# Altium project OK6010_DB.PrjPcb (part 1 of 2)
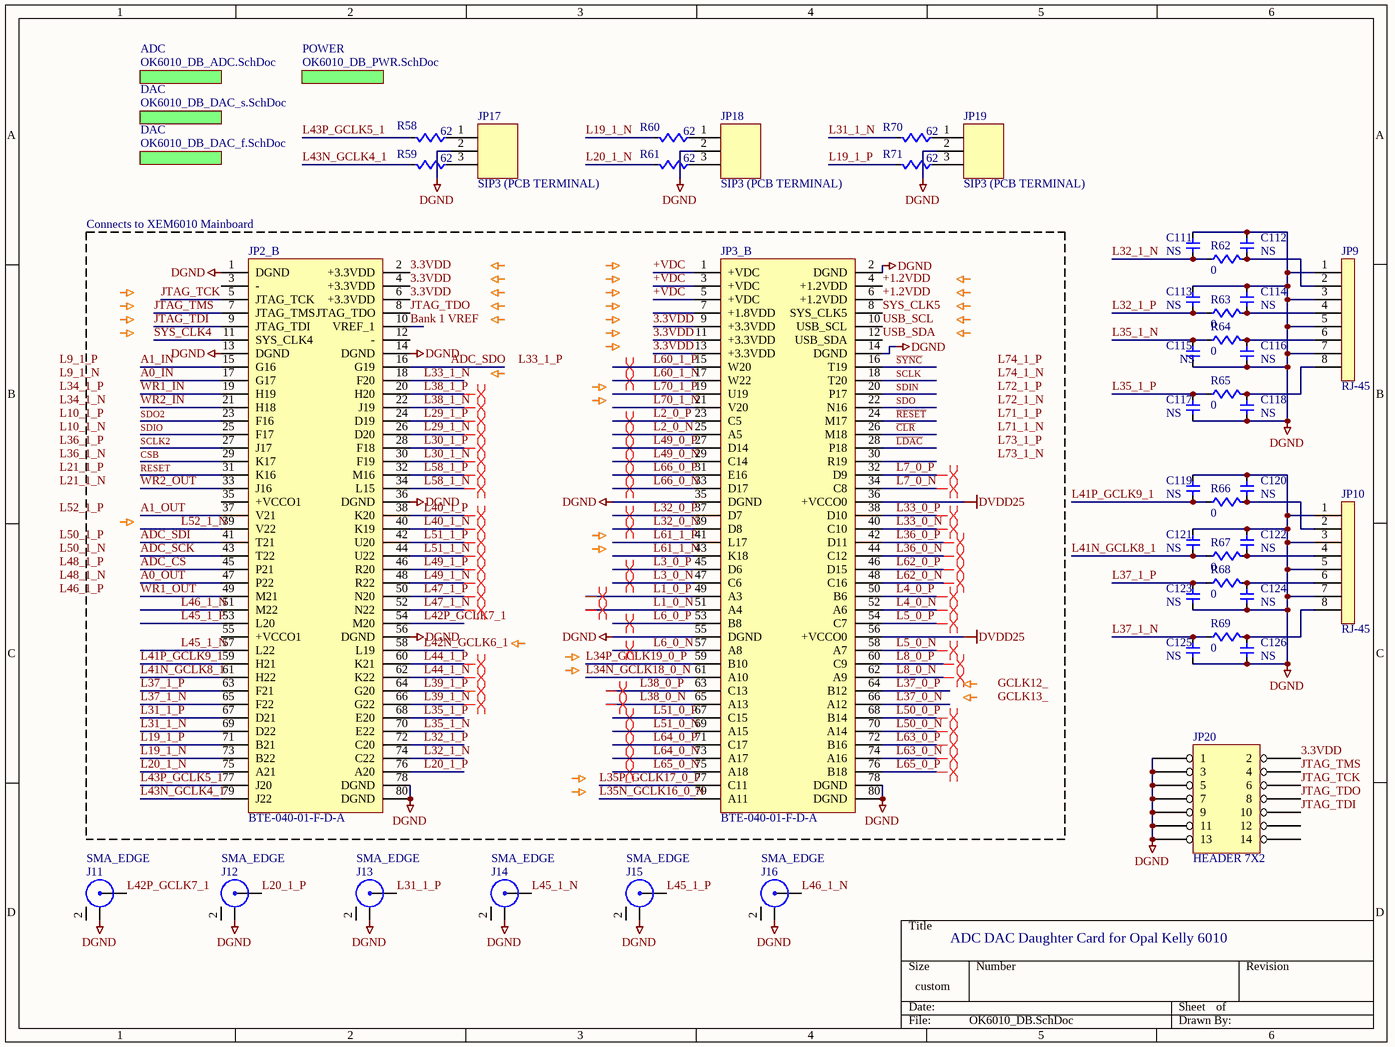
[diagram p0: OK6010_DB.SchDoc]
6 sheets, 268 parts. Net scope: global (net labels, ports and power ports of the same name join across sheets).
Board file: OK6010_DB.PcbDoc
Sheets:
  OK6010_DB.SchDoc
    ADC = OK6010_DB_ADC.SchDoc
    DAC = OK6010_DB_DAC_s.SchDoc
    DAC = OK6010_DB_DAC_f.SchDoc
    POWER = OK6010_DB_PWR.SchDoc
  OK6010_DB_pwr_bgt.SchDoc

## Sheet OK6010_DB.SchDoc
size 260 x 195 mm; PageSetup: Record=PageOptions|CenterHorizontal=True|CenterVertical=True|PrintScale=1.06|XCorrection=1.00|YCorrection=1.00|PrintKind=2|BorderSize=5000000|LeftOffset=0|BottomOffset=0|Orientation=2|PaperLength=1000|PaperWidth=1000|Scale=100|PaperSource=15|PrintQuality=600|MediaType=1|DitherType=10|PaperKind=Letter|PrintScaleMode=1

### Parts
C111  NS  [0603w]
C112  NS  [0603w]
C113  NS  [0603w]
C114  NS  [0603w]
C115  NS  [0603w]
C116  NS  [0603w]
C117  NS  [0603w]
C118  NS  [0603w]
C119  NS  [0603w]
C120  NS  [0603w]
C121  NS  [0603w]
C122  NS  [0603w]
C123  NS  [0603w]
C124  NS  [0603w]
C125  NS  [0603w]
C126  NS  [0603w]
J11  SMA_EDGE  [sma_edge]
J12  SMA_EDGE  [sma_edge]
J13  SMA_EDGE  [sma_edge]
J14  SMA_EDGE  [sma_edge]
J15  SMA_EDGE  [sma_edge]
J16  SMA_EDGE  [sma_edge]
JP2_B  BTE-040-01-F-D-A  [BTE-040-01-F-D-A]
JP3_B  BTE-040-01-F-D-A  [BTE-040-01-F-D-A]
JP9  RJ-45  [SMD_ETHERNET]
JP10  RJ-45  [SMD_ETHERNET]
JP17  SIP3 (PCB TERMINAL)  [SIP3MOLEX]
JP18  SIP3 (PCB TERMINAL)  [SIP3MOLEX]
JP19  SIP3 (PCB TERMINAL)  [SIP3MOLEX]
JP20  HEADER 7X2  [IDC14 SM 2MM]
R58  62  [0603w]
R59  62  [0603w]
R60  62  [0603w]
R61  62  [0603w]
R62  0  [0603w]
R63  0  [0603w]
R64  0  [0603w]
R65  0  [0603w]
R66  0  [0603w]
R67  0  [0603w]
R68  0  [0603w]
R69  0  [0603w]
R70  62  [0603w]
R71  62  [0603w]

### Blocks framed on the sheet
Connects to XEM6010 Mainboard: JP2_B JP3_B

### Sub-sheets
ADC = OK6010_DB_ADC.SchDoc: no entries
DAC = OK6010_DB_DAC_s.SchDoc: no entries
DAC = OK6010_DB_DAC_f.SchDoc: no entries
POWER = OK6010_DB_PWR.SchDoc: no entries

### Nets
DGND: C111.1 C112.1 C113.1 C114.1 C115.2 C116.2 C117.2 C118.2 C119.1 C120.1 C121.1 C122.1 C123.2 C124.2 C125.2 C126.2 J11.2(ground) J12.2(ground) J13.2(ground) J14.2(ground) J15.2(ground) J16.2(ground) JP2_B.1(DGND) JP2_B.13(DGND) JP2_B.14(DGND) JP2_B.36(DGND) JP2_B.56(DGND) JP2_B.78(DGND) JP2_B.80(DGND) JP3_B.2(DGND) JP3_B.14(DGND) JP3_B.35(DGND) JP3_B.55(DGND) JP3_B.78(DGND) JP3_B.80(DGND) JP9.1 JP9.3 JP9.5 JP9.7 JP10.1 JP10.3 JP10.5 JP10.7 JP17.2 JP18.2 JP19.2 JP20.1 JP20.3 JP20.5 JP20.7 JP20.9 JP20.11 JP20.13  [project net AGND]
DVDD25: JP3_B.36(+VCCO0) JP3_B.56(+VCCO0)
3.3VDD: JP2_B.2(+3.3VDD) JP2_B.4(+3.3VDD) JP2_B.6(+3.3VDD) JP3_B.9(+3.3VDD) JP3_B.11(+3.3VDD) JP3_B.13(+3.3VDD) JP20.2
+1.2VDD: JP3_B.4(+1.2VDD) JP3_B.6(+1.2VDD)
+VDC: JP3_B.1(+VDC) JP3_B.3(+VDC) JP3_B.5(+VDC)
A0_IN: JP2_B.17(G17)
A0_OUT: JP2_B.47(P22)
A1_IN: JP2_B.15(G16)
A1_OUT: JP2_B.37(V21)
ADC_CS: JP2_B.45(P21)
ADC_SCK: JP2_B.43(T22)
ADC_SDI: JP2_B.41(T21)
ADC_SDO: JP2_B.16(G19)
Bank 1 VREF: JP2_B.10(VREF_1)
~{CLR}: JP3_B.26(M18)
CSB: JP2_B.29(K17)
JTAG_TCK: JP2_B.5(JTAG_TCK) JP20.6
JTAG_TDI: JP2_B.9(JTAG_TDI) JP20.10
JTAG_TDO: JP2_B.8(JTAG_TDO) JP20.8
JTAG_TMS: JP2_B.7(JTAG_TMS) JP20.4
L1_0_N: JP3_B.51(A4)
L1_0_P: JP3_B.49(A3)
L2_0_N: JP3_B.25(A5)
L2_0_P: JP3_B.23(C5)
L3_0_N: JP3_B.47(C6)
L3_0_P: JP3_B.45(D6)
L4_0_N: JP3_B.52(A6)
L4_0_P: JP3_B.50(B6)
L5_0_N: JP3_B.58(A7)
L5_0_P: JP3_B.54(C7)
L6_0_N: JP3_B.57(A8)
L6_0_P: JP3_B.53(B8)
L7_0_N: JP3_B.34(C8)
L7_0_P: JP3_B.32(D9)
L8_0_N: JP3_B.62(A9)
L8_0_P: JP3_B.60(C9)
L19_1_N: JP2_B.73(B22) R60.2
L19_1_P: JP2_B.71(B21) R71.2
L20_1_N: JP2_B.75(A21) R61.2
L20_1_P: J12.1(signal) JP2_B.76(A20)
L29_1_N: JP2_B.26(D20)
L29_1_P: JP2_B.24(D19)
L30_1_N: JP2_B.30(F19)
L30_1_P: JP2_B.28(F18)
L31_1_N: JP2_B.69(D22) R70.2
L31_1_P: J13.1(signal) JP2_B.67(D21)
L32_0_N: JP3_B.39(D8)
L32_0_P: JP3_B.37(D7)
L32_1_N: C111.2 JP2_B.74(C22) R62.1
L32_1_P: C113.2 JP2_B.72(C20) R63.1
L33_0_N: JP3_B.40(C10)
L33_0_P: JP3_B.38(D10)
L33_1_N: JP2_B.18(F20)
L34N_GCLK18_0_N: JP3_B.61(A10)
L34P_GCLK19_0_P: JP3_B.59(B10)
L35_1_N: C115.1 JP2_B.70(E22) R64.1
L35_1_P: C117.1 JP2_B.68(E20) R65.1
L35N_GCLK16_0_N: JP3_B.79(A11)
L35P_GCLK17_0_P: JP3_B.77(C11)
L36_0_N: JP3_B.44(C12)
L36_0_P: JP3_B.42(D11)
L37_0_N: JP3_B.66(A12)
L37_0_P: JP3_B.64(B12)
L37_1_N: C125.1 JP2_B.65(F22) R69.1
L37_1_P: C123.1 JP2_B.63(F21) R68.1
L38_0_N: JP3_B.65(A13)
L38_0_P: JP3_B.63(C13)
L38_1_N: JP2_B.22(J19)
L38_1_P: JP2_B.20(H20)
L39_1_N: JP2_B.66(G22)
L39_1_P: JP2_B.64(G20)
L40_1_N: JP2_B.40(K19)
L40_1_P: JP2_B.38(K20)
L41N_GCLK8_1: C121.2 JP2_B.61(H22) R67.1
L41P_GCLK9_1: C119.2 JP2_B.59(H21) R66.1
L42N_GCLK6_1: JP2_B.58(L19)
L42P_GCLK7_1: J11.1(signal) JP2_B.54(M20)
L43N_GCLK4_1: JP2_B.79(J22) R59.2
L43P_GCLK5_1: JP2_B.77(J20) R58.2
L44_1_N: JP2_B.62(K22)
L44_1_P: JP2_B.60(K21)
L45_1_N: J14.1(signal) JP2_B.57(L22)
L45_1_P: J15.1(signal) JP2_B.53(L20)
L46_1_N: J16.1(signal) JP2_B.51(M22)
L47_1_N: JP2_B.52(N22)
L47_1_P: JP2_B.50(N20)
L49_0_N: JP3_B.29(C14)
L49_0_P: JP3_B.27(D14)
L49_1_N: JP2_B.48(R22)
L49_1_P: JP2_B.46(R20)
L50_0_N: JP3_B.70(A14)
L50_0_P: JP3_B.68(B14)
L51_0_N: JP3_B.69(A15)
L51_0_P: JP3_B.67(C15)
L51_1_N: JP2_B.44(U22)
L51_1_P: JP2_B.42(U20)
L52_1_N: JP2_B.39(V22)
L58_1_N: JP2_B.34(L15)
L58_1_P: JP2_B.32(M16)
L60_1_N: JP3_B.17(W22)
L60_1_P: JP3_B.15(W20)
L61_1_N: JP3_B.43(K18)
L61_1_P: JP3_B.41(L17)
L62_0_N: JP3_B.48(C16)
L62_0_P: JP3_B.46(D15)
L63_0_N: JP3_B.74(A16)
L63_0_P: JP3_B.72(B16)
L64_0_N: JP3_B.73(A17)
L64_0_P: JP3_B.71(C17)
L65_0_N: JP3_B.75(A18)
L65_0_P: JP3_B.76(B18)
L66_0_N: JP3_B.33(D17)
L66_0_P: JP3_B.31(E16)
L70_1_N: JP3_B.21(V20)
L70_1_P: JP3_B.19(U19)
~{LDAC}: JP3_B.28(P18)
~{RESET}: JP3_B.24(M17)
RESET: JP2_B.31(K16)
~{SYNC}: JP3_B.16(T19)
SCLK: JP3_B.18(T20)
SCLK2: JP2_B.27(J17)
SDIN: JP3_B.20(P17)
SDIO: JP2_B.25(F17)
SDO: JP3_B.22(N16)
SDO2: JP2_B.23(F16)
SYS_CLK4: JP2_B.11(SYS_CLK4)
SYS_CLK5: JP3_B.8(SYS_CLK5)
USB_SCL: JP3_B.10(USB_SCL)
USB_SDA: JP3_B.12(USB_SDA)
WR1_IN: JP2_B.19(H19)
WR1_OUT: JP2_B.49(M21)
WR2_IN: JP2_B.21(H18)
WR2_OUT: JP2_B.33(J16)
NetC112_2: C112.2 JP9.2 R62.2
NetC114_2: C114.2 JP9.4 R63.2
NetC116_1: C116.1 JP9.6 R64.2
NetC118_1: C118.1 JP9.8 R65.2
NetC120_2: C120.2 JP10.2 R66.2
NetC122_2: C122.2 JP10.4 R67.2
NetC124_1: C124.1 JP10.6 R68.2
NetC126_1: C126.1 JP10.8 R69.2
NetJP17_1: JP17.1 R58.1
NetJP17_3: JP17.3 R59.1
NetJP18_1: JP18.1 R60.1
NetJP18_3: JP18.3 R61.1
NetJP19_1: JP19.1 R70.1
NetJP19_3: JP19.3 R71.1

Not connected (* = marked no-connect by the designer): JP2_B 3(-) 12(-) 35(+VCCO1) 55(+VCCO1); JP3_B 7(+1.8VDD) 30(R19); JP20 12 14

### Layout directives
differential pair: L1_0_N, L1_0_P, L2_0_N, L2_0_P, L3_0_N, L3_0_P, L4_0_N, L4_0_P, L5_0_N, L5_0_P, L6_0_N, L6_0_P, L7_0_N, L7_0_P, L8_0_N, L8_0_P, L29_1_N, L29_1_P, L30_1_N, L30_1_P, L32_0_N, L32_0_P, L33_0_N, L33_0_P, L36_0_N, L36_0_P, L38_0_N, L38_0_P, L38_1_N, L38_1_P, L39_1_N, L39_1_P, L40_1_N, L40_1_P, L44_1_N, L44_1_P, L47_1_N, L47_1_P, L49_0_N, L49_0_P, L49_1_N, L49_1_P, L50_0_N, L50_0_P, L51_0_N, L51_0_P, L51_1_N, L51_1_P, L58_1_N, L58_1_P, L60_1_N, L60_1_P, L62_0_N, L62_0_P, L63_0_N, L63_0_P, L64_0_N, L64_0_P, L65_0_N, L65_0_P, L66_0_N, L66_0_P

### Notes on the sheet
- ADC DAC Daughter Card for Opal Kelly 6010
- Labels drawn without touching a wire or pin: GCLK12_, GCLK13_, L9_1_N, L9_1_P, L10_1_N, L10_1_P, L21_1_N, L21_1_P, L33_1_P, L34_1_N, L34_1_P, L36_1_N, L36_1_P, L46_1_P, L48_1_N, L48_1_P, L50_1_N, L50_1_P, L52_1_P, L71_1_N, L71_1_P, L72_1_N, L72_1_P, L73_1_N, L73_1_P, L74_1_N, L74_1_P

### Library data of the parts
C111-C126 = CAP_SM: capacitor
J11-J16 = SMA_EDGE: sma edge connector; Supplier 1: Digi-Key; Supplier Part Number 1: ACX1426-ND
JP2_B = BTE-040-01-F-D-A XEM6010_JP2: Samtec Connector 0.8mm 80pin; Supplier 1: Newark; Supplier Part Number 1: 89M7080
JP3_B = BTE-040-01-F-D-A XEM6010_JP3: Samtec Connector 0.8mm 80pin; Supplier 1: Newark; Supplier Part Number 1: 89M7080
JP9 JP10 = SIP8: ethernet connector; Supplier 1: Digi-Key; Supplier Part Number 1: RJSSE-5080-ND
JP17-JP19 = SIP3 (PCB TERMINAL): 3 pin molex connector; Supplier 1: Digi-Key; Supplier Part Number 1: WM2745-ND
JP20 = HEADER 7X2: 14 pin 2mm IDC connector; Supplier 1: Digi-Key; Supplier Part Number 1: WM18641-ND
R58-R71 = RES_SM: resistor; Supplier 1: Digi-Key
  R58-R61 R70 R71: Supplier Part Number 1: 541-62.0HCT-ND
  R62-R69: Supplier Part Number 1: P0.0GCT-ND

## Sheet OK6010_DB_ADC.SchDoc
size 260 x 195 mm; PageSetup: Record=PageOptions|CenterHorizontal=True|CenterVertical=True|PrintScale=0.82|XCorrection=1.00|YCorrection=1.00|PrintKind=2|BorderSize=5000000|LeftOffset=0|BottomOffset=0|Orientation=2|PaperLength=1000|PaperWidth=1000|Scale=100|PaperSource=15|PrintQuality=600|MediaType=1|DitherType=10|PaperKind=Letter|PrintScaleMode=1
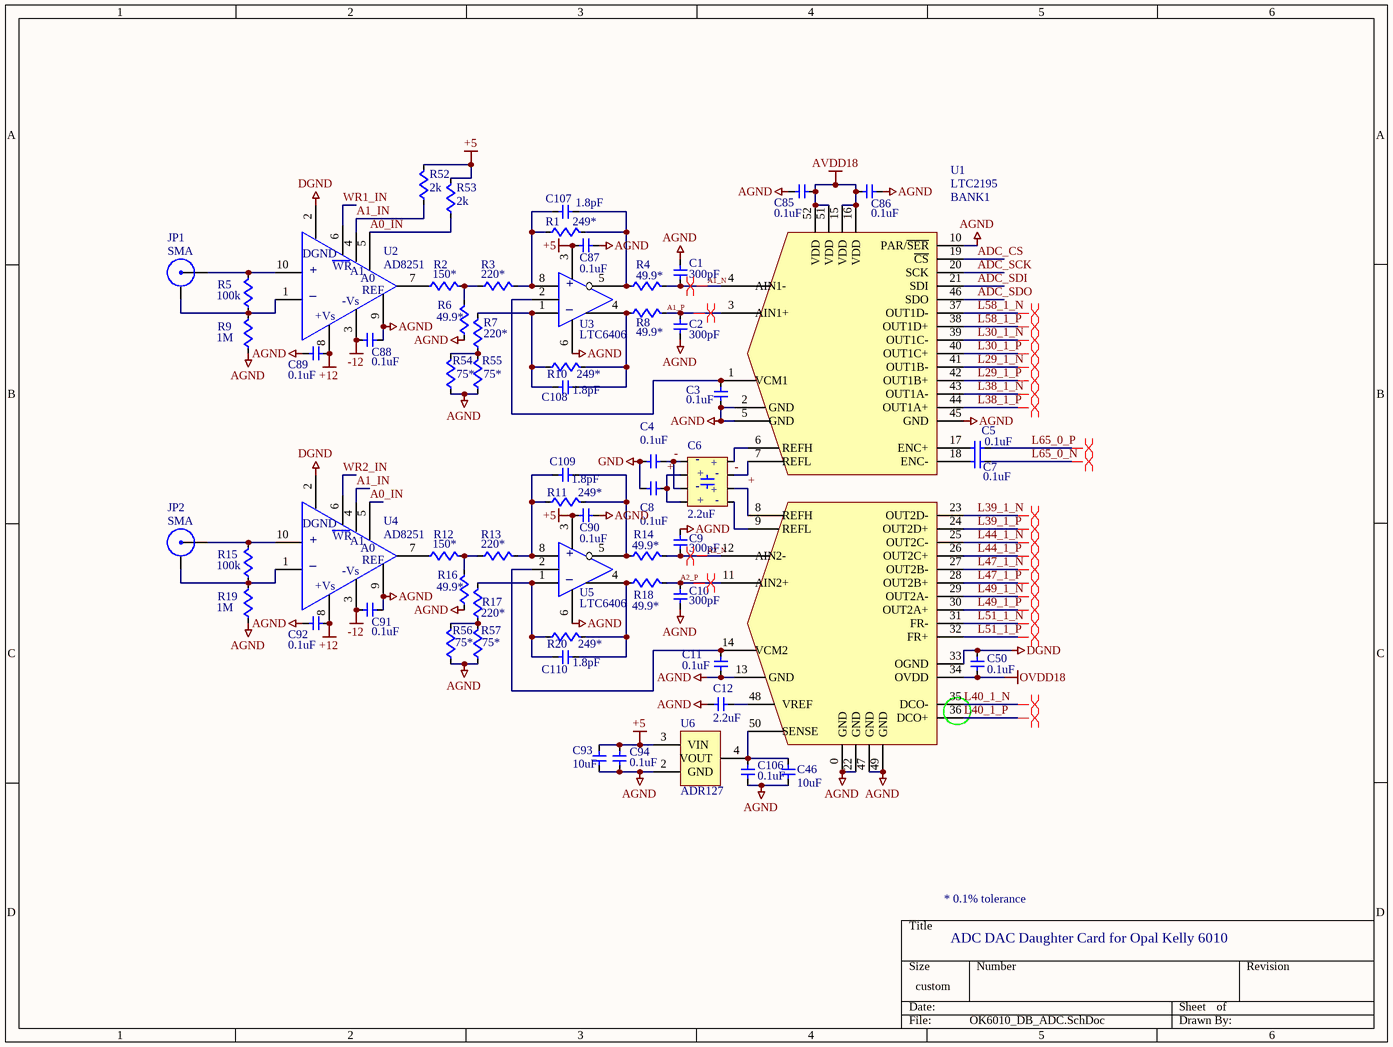
[diagram p1: OK6010_DB_ADC.SchDoc]

### Parts
C1  300pF  [0603w]
C2  300pF  [0603w]
C3  0.1uF  [0603w]
C4  0.1uF  [0603w]
C5  0.1uF  [1206]
C6  2.2uF  [0805 CLL]
C7  0.1uF  [1206]
C8  0.1uF  [0603w]
C9  300pF  [0603w]
C10  300pF  [0603w]
C11  0.1uF  [0603w]
C12  2.2uF  [0603w]
C46  10uF  [0603w]
C50  0.1uF  [0603w]
C85  0.1uF  [0603w]
C86  0.1uF  [0603w]
C87  0.1uF  [0603w]
C88  0.1uF  [0603w]
C89  0.1uF  [0603w]
C90  0.1uF  [0603w]
C91  0.1uF  [0603w]
C92  0.1uF  [0603w]
C93  10uF  [0603w]
C94  0.1uF  [0603w]
C106  0.1uF  [0603w]
C107  1.8pF  [0603w]
C108  1.8pF  [0603w]
C109  1.8pF  [0603w]
C110  1.8pF  [0603w]
JP1  SMA  [sma_pcb_200]
JP2  SMA  [sma_pcb_200]
R1  249*  [0603w]
R2  150*  [0603w]
R3  220*  [0603w]
R4  49.9*  [0603w]
R5  100k  [0603w]
R6  49.9*  [0603w]
R7  220*  [0603w]
R8  49.9*  [0603w]
R9  1M  [0603w]
R10  249*  [0603w]
R11  249*  [0603w]
R12  150*  [0603w]
R13  220*  [0603w]
R14  49.9*  [0603w]
R15  100k  [0603w]
R16  49.9*  [0603w]
R17  220*  [0603w]
R18  49.9*  [0603w]
R19  1M  [0603w]
R20  249*  [0603w]
R52  2k  [0603w]
R53  2k  [0603w]
R54  75*  [0603w]
R55  75*  [0603w]
R56  75*  [0603w]
R57  75*  [0603w]
U1  LTC2195  [UKG - QFN52]
U2  AD8251  [MSOP10sm]
U3  LTC6406  [MSOP08]
U4  AD8251  [MSOP10sm]
U5  LTC6406  [MSOP08]
U6  ADR127  [TSOT-6]

### Nets
+5: C87.1 C90.1 C93.1 C94.2 R52.2 R53.2 U3.3 U5.3 U6.3(VIN)
+12: C89.1 C92.1 U2.8 U4.8
-12: C88.1 C91.1 U2.3 U4.3
AGND: C1.1 C2.2 C3.2 C4.2 C8.2 C9.1 C10.2 C11.2 C12.2 C46.2 C50.1 C85.2 C86.2 C87.2 C88.2 C89.2 C90.2 C91.2 C92.2 C93.2 C94.1 C106.1 R6.1 R9.1 R16.1 R19.1 R54.1 R55.1 R56.1 R57.1 U1.0(GND) U1.2(GND) U1.5(GND) U1.10(PAR/~{SER}) U1.13(GND) U1.22(GND) U1.33(OGND) U1.45(GND) U1.47(GND) U1.49(GND) U2.2 U2.9 U3.6 U4.2 U4.9 U5.6 U6.2(GND)  [also labelled DGND, GND]
AVDD18: C85.1 C86.1 U1.15(VDD) U1.16(VDD) U1.51(VDD) U1.52(VDD)
OVDD18: C50.2 U1.34(OVDD)
+: C6.2 C6.4 C6.6 C8.1 U1.8(REFH)
-: C4.1 C6.1 C6.3 C6.7 U1.7(REFL)
A0_IN: R53.1 U2.5 U4.5
A1_IN: R52.1 U2.4 U4.4
A1_N: C1.2 R4.2 U1.4(AIN1-)
A1_P: C2.1 R8.2 U1.3(AIN1+)
A2_N: C9.2 R14.2 U1.12(AIN2-)
A2_P: C10.1 R18.2 U1.11(AIN2+)
ADC_CS: U1.19(~{CS})
ADC_SCK: U1.20(SCK)
ADC_SDI: U1.21(SDI)
ADC_SDO: U1.46(SDO)
L29_1_N: U1.41(OUT1B-)
L29_1_P: U1.42(OUT1B+)
L30_1_N: U1.39(OUT1C-)
L30_1_P: U1.40(OUT1C+)
L38_1_N: U1.43(OUT1A-)
L38_1_P: U1.44(OUT1A+)
L39_1_N: U1.23(OUT2D-)
L39_1_P: U1.24(OUT2D+)
L40_1_N: U1.35(DCO-)
L40_1_P: U1.36(DCO+)
L44_1_N: U1.25(OUT2C-)
L44_1_P: U1.26(OUT2C+)
L47_1_N: U1.27(OUT2B-)
L47_1_P: U1.28(OUT2B+)
L49_1_N: U1.29(OUT2A-)
L49_1_P: U1.30(OUT2A+)
L51_1_N: U1.31(FR-)
L51_1_P: U1.32(FR+)
L58_1_N: U1.37(OUT1D-)
L58_1_P: U1.38(OUT1D+)
L65_0_N: C7.2
L65_0_P: C5.2
WR1_IN: U2.6
WR2_IN: U4.6
NetC3_1: C3.1 U1.1(VCM1) U3.2
NetC5_1: C5.1 U1.17(ENC+)
NetC6_5: C6.5 U1.9(REFL)
NetC6_8: C6.8 U1.6(REFH)
NetC7_1: C7.1 U1.18(ENC-)
NetC11_1: C11.1 U1.14(VCM2) U5.2
NetC12_1: C12.1 U1.48(VREF)
NetC46_1: C46.1 C106.2 U1.50(SENSE) U6.4(VOUT)
NetC107_1: C107.1 R1.1 R3.2 U3.8
NetC107_2: C107.2 R1.2 R4.1 U3.5
NetC108_1: C108.1 R7.2 R10.1 U3.1
NetC108_2: C108.2 R8.1 R10.2 U3.4
NetC109_1: C109.1 R11.1 R13.2 U5.8
NetC109_2: C109.2 R11.2 R14.1 U5.5
NetC110_1: C110.1 R17.2 R20.1 U5.1
NetC110_2: C110.2 R18.1 R20.2 U5.4
NetJP1_0: JP1.0(ground) R5.1 R9.2 U2.1
NetJP1_1: JP1.1(signal) R5.2 U2.10
NetJP2_0: JP2.0(ground) R15.1 R19.2 U4.1
NetJP2_1: JP2.1(signal) R15.2 U4.10
NetR2_1: R2.1 U2.7
NetR2_2: R2.2 R3.1 R6.2
NetR7_1: R7.1 R54.2 R55.2
NetR12_1: R12.1 U4.7
NetR12_2: R12.2 R13.1 R16.2
NetR17_1: R17.1 R56.2 R57.2

Not connected (* = marked no-connect by the designer): U6 1(NC) 5(NC) 6(NC)

### Layout directives
differential pair: A1_N, A1_P, A2_N, A2_P, L29_1_N, L29_1_P, L30_1_N, L30_1_P, L38_1_N, L38_1_P, L39_1_N, L39_1_P, L40_1_N, L40_1_P, L44_1_N, L44_1_P, L47_1_N, L47_1_P, L49_1_N, L49_1_P, L51_1_N, L51_1_P, L58_1_N, L58_1_P, L65_0_N, L65_0_P

### Notes on the sheet
- (near U1) BANK1
- * 0.1% tolerance
- ADC DAC Daughter Card for Opal Kelly 6010
- (in symbol AD8139) +; _
- (in symbol AD8251) DGND; WR; +; A1; A0; _; REF; -Vs; +Vs
- (in symbol CAP_SM Interdigitated) +

### Library data of the parts
C1 C2 C9 C10 C107-C110 = CAP_SM_1: capacitor; Supplier 1: Digi-Key
  C1 C2 C9 C10: Supplier Part Number 1: 490-1438-1-ND
  C107-C110: Supplier Part Number 1: 712-1328-1-ND
C3 C4 C8 C11 C50 C85 C86 C88-C92 C94 C106 = CAP_SM_1: capacitor; Manufacturer: Kemet; Manufacturer Part Number: C0603C104K3RACTU; Capacitance: 0.1µF; Temperature Coefficient: X7R; Tolerance: ±10%; Voltage - Rated: 25V; Applications: General Purpose; Category: Capacitors; ComponentLink1Description: http://www.kemet.com/datasheets&C0603C104K3RACTU; ComponentLink1URL: http://www.kemet.com/datasheets&C0603C104K3RACTU; Features: -; Lead Spacing: -; Lead Style: -; Mounting Type: Surface Mount, MLCC; Operating Temperature: -55°C ~ 125°C; Package / Case: 0603 (1608 Metric); Packaging: Cut Tape (CT); Pricing 1: 10=0.075, 100=0.027, 250=0.01952, 500=0.0144, 1000=0.00975 (USD); Ratings: -; RoHS: RoHS Compliant; Size / Dimension: 0.063" L x 0.031" W (1.60mm x 0.80mm); Stock 1: 1185883; Supplier 1: Digi-Key; Supplier Part Number 1: 399-1281-1-ND; Thickness: 0.034" (0.87mm)
C5 C7 = CAP_SM_1: capacitor; Manufacturer: Murata Electronics North America; Manufacturer Part Number: GRM31C5C1E104JA01L; Description: CAP CER .1UF 25V 5% C0G 1206; Capacitance: 0.1µF; Voltage - Rated: 25V; Tolerance: ±5%; Temperature Coefficient: C0G, NP0; Supplier 1: Digi-Key; Supplier Part Number 1: 490-1767-1-ND; RoHS: RoHS Compliant; Category: Capacitors; Stock 1: 374793; Pricing 1: 1=0.57, 10=0.48, 50=0.3436, 100=0.3007, 250=0.23628, 500=0.2148, 1000=0.17184 (USD); Mounting Type: Surface Mount, MLCC; Operating Temperature: -55°C ~ 125°C; Applications: General Purpose; Ratings: -; Package / Case: 1206 (3216 Metric); Size / Dimension: 0.126" L x 0.063" W (3.20mm x 1.60mm); Height: -; Thickness: 0.071" (1.80mm); Lead Spacing: -; Features: -; Packaging: Cut Tape (CT); Lead Style: -; ComponentLink1URL: http://search.murata.co.jp/Ceramy/image/img/PDF/ENG/GRM31C5C1E104JA01.pdf; ComponentLink1Description: http://search.murata.co.jp/Ceramy/image/img/PDF/ENG/GRM31C5C1E104JA01.pdf
C6 = CAP_SM Interdigitated: INTERDIGITATED capacitor; Manufacturer: TDK Corporation; Manufacturer Part Number: CLLE1AX7S0G225M/0.95; Description: CAP LOW ESL 2.2UF 4V X7S 0805; Capacitance: 2.2µF; Voltage - Rated: 4V; Tolerance: ±20%; Temperature Coefficient: X7S; Supplier 1: Digi-Key; Supplier Part Number 1: 445-3406-1-ND; RoHS: RoHS Compliant; Category: Capacitors; Stock 1: 11249; Pricing 1: 1=0.68, 10=0.54, 100=0.325, 250=0.24376, 500=0.208, 1000=0.1625 (USD); Mounting Type: Surface Mount, MLCC; Operating Temperature: -55°C ~ 125°C; Applications: General Purpose; Ratings: -; Package / Case: 0805 (2012 Metric); Size / Dimension: 0.079" L x 0.049" W (2.00mm x 1.25mm); Height: -; Thickness: 0.037" (0.95mm); Lead Spacing: -; Features: Low ESL (Multi-Terminal); Packaging: Cut Tape (CT); Lead Style: -; ComponentLink1URL: http://www.tdk.com/pdf/uli_A11.pdf; ComponentLink1Description: http://www.tdk.com/pdf/uli_A11.pdf
C12 = CAP_SM_1: capacitor; Manufacturer: AVX Corporation; Manufacturer Part Number: 06036C225KAT2A; Description: CAP CER 2.2UF 6.3V X7R 10% 0603; Capacitance: 2.2µF; Voltage - Rated: 6.3V; Tolerance: ±10%; Temperature Coefficient: X7R; Supplier 1: Digi-Key; Supplier Part Number 1: 478-5316-1-ND; RoHS: RoHS Compliant; Category: Capacitors; Stock 1: 284343; Pricing 1: 10=0.209, 100=0.1235, 500=0.07126, 1000=0.0494 (USD); Mounting Type: Surface Mount, MLCC; Operating Temperature: -55°C ~ 125°C; Applications: General Purpose; Ratings: -; Package / Case: 0603 (1608 Metric); Size / Dimension: 0.063" L x 0.032" W (1.60mm x 0.81mm); Height: -; Thickness: 0.035" (0.90mm); Lead Spacing: -; Features: -; Packaging: Cut Tape (CT); Lead Style: -; ComponentLink1URL: http://www.avx.com/docs/Catalogs/cx7r.pdf; ComponentLink1Description: http://www.avx.com/docs/Catalogs/cx7r.pdf
C46 C93 = CAP_SM_1: capacitor; Manufacturer: Murata Electronics North America; Manufacturer Part Number: GRM188R60J106ME47D; Description: CAP CER 10UF 6.3V X5R 0603; Capacitance: 10µF; Voltage - Rated: 6.3V; Tolerance: ±20%; Temperature Coefficient: X5R; Supplier 1: Digi-Key; Supplier Part Number 1: 490-3896-1-ND; RoHS: RoHS Compliant; Category: Capacitors; Stock 1: 1274844; Pricing 1: 1=0.47, 10=0.369, 50=0.2428, 100=0.1926, 250=0.14236, 500=0.11056, 1000=0.0871 (USD); Mounting Type: Surface Mount, MLCC; Operating Temperature: -55°C ~ 85°C; Applications: General Purpose; Ratings: -; Package / Case: 0603 (1608 Metric); Size / Dimension: 0.063" L x 0.031" W (1.60mm x 0.80mm); Height: -; Thickness: 0.035" (0.90mm); Lead Spacing: -; Features: -; Packaging: Cut Tape (CT); Lead Style: -; ComponentLink1URL: http://search.murata.co.jp/Ceramy/image/img/PDF/ENG/GRM188R60J106ME47.pdf; ComponentLink1Description: http://search.murata.co.jp/Ceramy/image/img/PDF/ENG/GRM188R60J106ME47.pdf
C87 = CAP_SM_1: capacitor; Manufacturer: Kemet; Manufacturer Part Number: C0603C104K3RACTU; Description: CAP .1UF 25V CERAMIC X7R 0603; Capacitance: 0.1µF; Voltage - Rated: 25V; Tolerance: ±10%; Temperature Coefficient: X7R; Supplier 1: Digi-Key; Supplier Part Number 1: 399-1281-1-ND; RoHS: RoHS Compliant; Category: Capacitors; Stock 1: 1185883; Pricing 1: 10=0.075, 100=0.027, 250=0.01952, 500=0.0144, 1000=0.00975 (USD); Mounting Type: Surface Mount, MLCC; Operating Temperature: -55°C ~ 125°C; Applications: General Purpose; Ratings: -; Package / Case: 0603 (1608 Metric); Size / Dimension: 0.063" L x 0.031" W (1.60mm x 0.80mm); Height: -; Thickness: 0.034" (0.87mm); Lead Spacing: -; Features: -; Packaging: Cut Tape (CT); Lead Style: -; ComponentLink1URL: http://www.kemet.com/datasheets&C0603C104K3RACTU; ComponentLink1Description: http://www.kemet.com/datasheets&C0603C104K3RACTU
JP1 JP2 = SMA_EDGE: sma connector; Manufacturer: TE Connectivity; Manufacturer Part Number: 5-1814832-1; Connector Type: Jack, Female Sockets; Contact Termination: Solder; Frequency - Max: 3GHz; Impedance: 50 Ohm; Cable Group: -; Category: Connectors, Interconnects; Color: -; ComponentLink1Description: http://documents.tycoelectronics.com/commerce/DocumentDelivery/DDEController?Action=srchrtrv&DocNm=1814832&DocType=CD&DocLang=EN; ComponentLink1URL: http://documents.tycoelectronics.com/commerce/DocumentDelivery/DDEController?Action=srchrtrv&DocNm=1814832&DocType=CD&DocLang=EN; Connector Style: SMA; Fastening Type: Threaded; Features: -; Mounting Type: Through Hole; Packaging: Bulk; Pricing 1: 1=2.7, 25=2.322, 50=2.052, 100=1.836, 250=1.62, 500=1.4364 (USD); RoHS: RoHS Compliant; Stock 1: 22563; Supplier 1: Digi-Key; Supplier Part Number 1: A97594-ND
R1-R3 R7 R10-R13 R17 R20 = RES_SM: resistor; Supplier 1: Digi-Key
  R1 R10 R11 R20: Supplier Part Number 1: RNCS0603BKE249RCT-ND
  R2 R12: Supplier Part Number 1: RNCS0603BKE150RCT-ND
  R3 R7 R13 R17: Supplier Part Number 1: RG16P220BCT-ND
R4 R6 R8 R14 R16 R18 = RES_SM: resistor; Manufacturer: Stackpole Electronics Inc; Manufacturer Part Number: RNCS0603BKE49R9; Description: RES 1.00M OHM 1/10W 1% 0603 SMD; Resistance (Ohms): 49.9; Power (Watts): 0.063W, 1/16W; Temperature Coefficient: ±25ppm/°C; Tolerance: ±0.1%; Supplier 1: Digi-Key; Supplier Part Number 1: RNCS0603BKE49R9CT-ND; RoHS: RoHS Compliant; Category: Resistors; Stock 1: 13782; Pricing 1: 1=0.7, 10=0.475, 50=0.2876, 100=0.2375, 250=0.18752, 500=0.16 (USD); Composition: Thin Film; Features: Anti-Corrosive, Moisture Resistant; Size / Dimension: 0.061" L x 0.031" W (1.55mm x 0.80mm); Height: 0.018" (0.45mm); Number of Terminations: 2; Packaging: Cut Tape (CT); Package / Case: 0603 (1608 Metric); ComponentLink1URL: http://www.seielect.com/Catalog/SEI-rncs.pdf; ComponentLink1Description: http://www.seielect.com/Catalog/SEI-rncs.pdf
R5 R15 = RES_SM: resistor; Manufacturer: Yageo; Manufacturer Part Number: RC0603FR-07100KL; Description: RES 100K OHM 1/10W 1% 0603 SMD; Power (Watts): 0.1W, 1/10W; Temperature Coefficient: ±100ppm/°C; Tolerance: ±1%; Supplier 1: Digi-Key; Supplier Part Number 1: 311-100KHRCT-ND; RoHS: RoHS Compliant; Category: Resistors; Stock 1: 3397757; Pricing 1: 10=0.014, 50=0.0104, 100=0.0079, 250=0.00584, 500=0.00432, 1000=0.00288 (USD); Resistance (Ohms): 100K; Composition: Thick Film; Features: -; Size / Dimension: 0.063" L x 0.031" W (1.60mm x 0.80mm); Height: 0.018" (0.45mm); Number of Terminations: 2; Packaging: Cut Tape (CT); Package / Case: 0603 (1608 Metric); ComponentLink1URL: http://www.yageo.com/documents/recent/PYu-RC0603_51_RoHS_L_4.pdf; ComponentLink1Description: http://www.yageo.com/documents/recent/PYu-RC0603_51_RoHS_L_4.pdf
R9 R19 = RES_SM: resistor; Manufacturer: Yageo; Manufacturer Part Number: RC0603FR-071ML; Description: RES 1.00M OHM 1/10W 1% 0603 SMD; Power (Watts): 0.1W, 1/10W; Temperature Coefficient: ±100ppm/°C; Tolerance: ±1%; Supplier 1: Digi-Key; Supplier Part Number 1: 311-1.00MHRCT-ND; RoHS: RoHS Compliant; Category: Resistors; Stock 1: 1849601; Pricing 1: 10=0.014, 50=0.0104, 100=0.0079, 250=0.00584, 500=0.00432, 1000=0.00288 (USD); Resistance (Ohms): 1M; Composition: Thick Film; Features: -; Size / Dimension: 0.063" L x 0.031" W (1.60mm x 0.80mm); Height: 0.018" (0.45mm); Number of Terminations: 2; Packaging: Cut Tape (CT); Package / Case: 0603 (1608 Metric); ComponentLink1URL: http://www.yageo.com/documents/recent/PYu-RC0603_51_RoHS_L_4.pdf; ComponentLink1Description: http://www.yageo.com/documents/recent/PYu-RC0603_51_RoHS_L_4.pdf
R52 R53 = RES_SM: resistor; Manufacturer: Yageo; Manufacturer Part Number: RC0603FR-072KL; Description: RES 2.00K OHM 1/10W 1% 0603 SMD; Power (Watts): 0.1W, 1/10W; Temperature Coefficient: ±100ppm/°C; Tolerance: ±1%; Supplier 1: Digi-Key; Supplier Part Number 1: 311-2.00KHRCT-ND; RoHS: RoHS Compliant; Category: Resistors; Stock 1: 1136096; Pricing 1: 10=0.014, 50=0.0104, 100=0.0079, 250=0.00584, 500=0.00432, 1000=0.00288 (USD); Resistance (Ohms): 2K; Composition: Thick Film; Features: -; Size / Dimension: 0.063" L x 0.031" W (1.60mm x 0.80mm); Height: 0.018" (0.45mm); Number of Terminations: 2; Packaging: Cut Tape (CT); Package / Case: 0603 (1608 Metric); ComponentLink1URL: http://www.yageo.com/documents/recent/PYu-RC0603_51_RoHS_L_4.pdf; ComponentLink1Description: http://www.yageo.com/documents/recent/PYu-RC0603_51_RoHS_L_4.pdf
R54-R57 = RES_SM: resistor; Manufacturer: Stackpole Electronics Inc; Manufacturer Part Number: RNCS0603BKE75R0; Description: RES 1/16W 75 OHM 0.1% 0603; Resistance (Ohms): 75; Power (Watts): 0.063W, 1/16W; Temperature Coefficient: ±25ppm/°C; Tolerance: ±0.1%; Supplier 1: Digi-Key; Supplier Part Number 1: RNCS0603BKE75R0CT-ND; RoHS: RoHS Compliant; Category: Resistors; Stock 1: 2583; Pricing 1: 1=0.7, 10=0.475, 50=0.2876, 100=0.2375, 250=0.18752, 500=0.16 (USD); Composition: Thin Film; Features: Anti-Corrosive, Moisture Resistant; Size / Dimension: 0.061" L x 0.031" W (1.55mm x 0.80mm); Height: 0.018" (0.45mm); Number of Terminations: 2; Packaging: Cut Tape (CT); Package / Case: 0603 (1608 Metric); ComponentLink1URL: http://www.seielect.com/Catalog/SEI-rncs.pdf; ComponentLink1Description: http://www.seielect.com/Catalog/SEI-rncs.pdf
U1 = LTC2195: 16 bit, low power, dual ADC; Supplier 1: Digi-Key; Supplier Part Number 1: LTC2195CUKG#PBF-ND
U2 = AD8251: Programmable Gain Instumentation Amp; Supplier 1: Digi-Key; Supplier Part Number 1: AD8251ARMZ-ND
U3 U5 = AD8139: Differential ADC Driver; Supplier 1: Digi-Key; Supplier Part Number 1: LTC6406CMS8E#PBF-ND
U4 = AD8251: IC AMP INST ICMOS LDRIFT 10MSOP; Supplier 1: Digi-Key; Supplier Part Number 1: AD8251ARMZ-ND
U6 = ADR12x: Voltage Reference; Manufacturer: Analog Devices Inc; Manufacturer Part Number: ADR127AUJZ-REEL7; Description: IC V-REF PREC 1.25V TSOT-23-6; Reference Type: Series, Precision; Voltage - Output: 1.25V; Tolerance: ±0.24%; Temperature Coefficient: 25ppm/°C; Voltage - Input: 2.7 V ~ 18 V; Number of Channels: 1; Current - Quiescent: 95µA; Current - Output: 5mA; Supplier 1: Digi-Key; Supplier Part Number 1: ADR127AUJZ-REEL7CT-ND; RoHS: RoHS Compliant; Category: Integrated Circuits (ICs); Stock 1: 17098; Pricing 1: 1=3.22, 25=2.484, 100=2.254, 250=2.024, 500=1.748 (USD); Current - Cathode: -; Operating Temperature: -40°C ~ 125°C; Mounting Type: Surface Mount; Package / Case: TSOT-23-6, TSOT-6; Supplier Device Package: TSOT-6; Packaging: Cut Tape (CT); ComponentLink1URL: http://www.analog.com/static/imported-files/Data_Sheets/ADR121_125_127.pdf; ComponentLink1Description: http://www.analog.com/static/imported-files/Data_Sheets/ADR121_125_127.pdf

## Sheet OK6010_DB_DAC_s.SchDoc
size 260 x 195 mm; PageSetup: Record=PageOptions|CenterHorizontal=True|CenterVertical=True|PrintScale=0.82|XCorrection=1.00|YCorrection=1.00|PrintKind=2|BorderSize=5000000|LeftOffset=0|BottomOffset=0|Orientation=2|PaperLength=1000|PaperWidth=1000|Scale=100|PaperSource=15|PrintQuality=600|MediaType=1|DitherType=10|PaperKind=Letter|PrintScaleMode=1
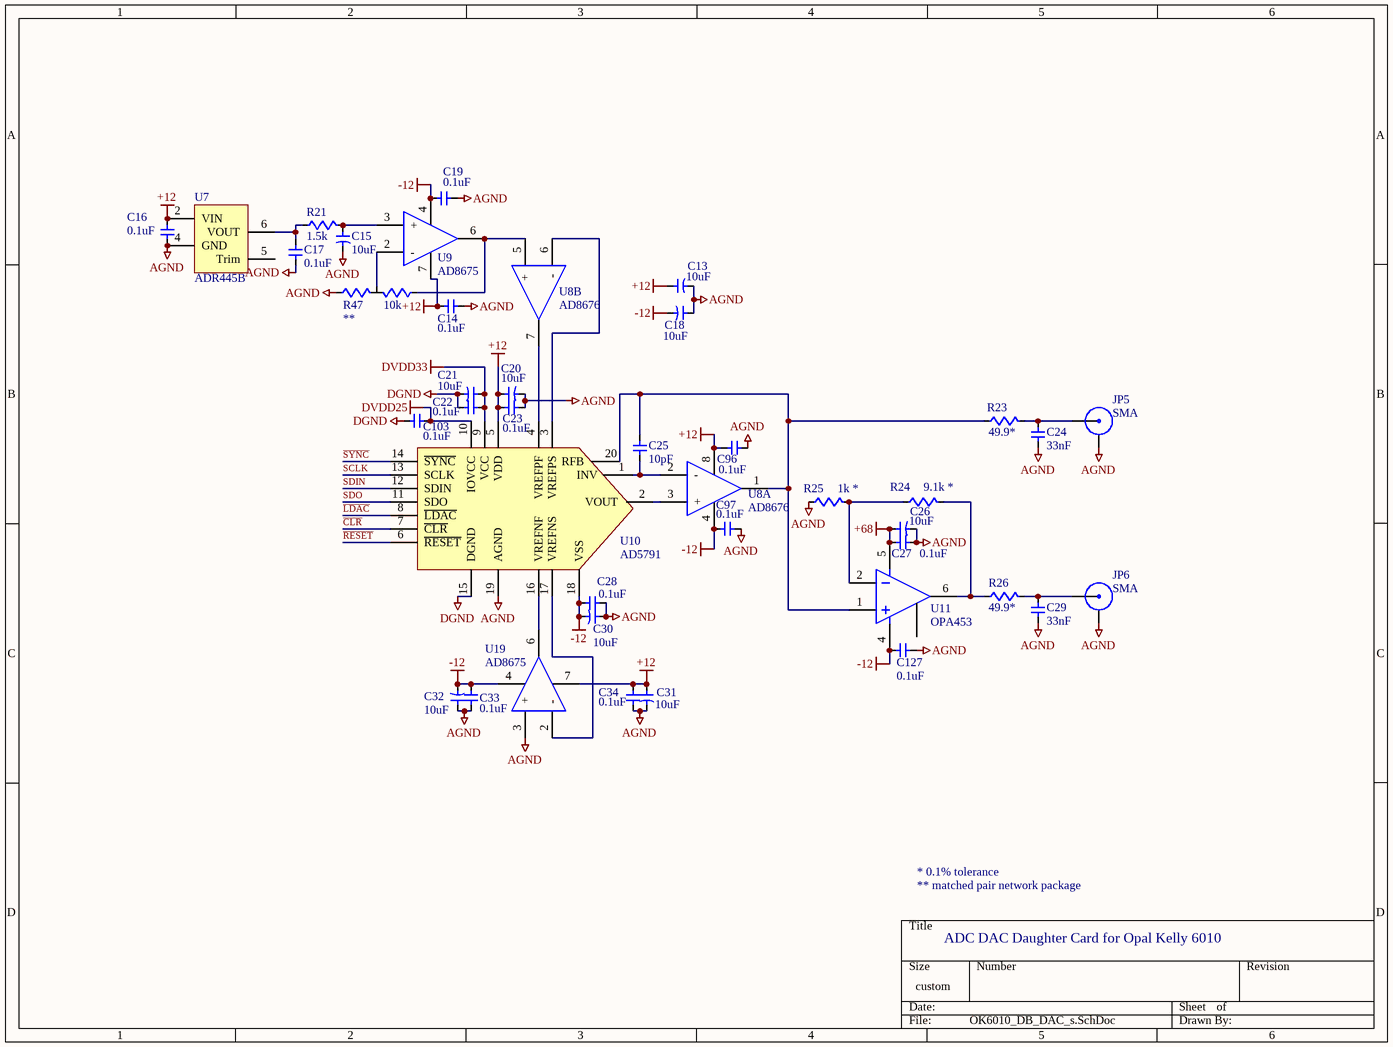
[diagram p2: OK6010_DB_DAC_s.SchDoc]

### Parts
C13  10uF  [1206]
C14  0.1uF  [0603w]
C15  10uF  [1206]
C16  0.1uF  [0603w]
C17  0.1uF  [0603w]
C18  10uF  [1206]
C19  0.1uF  [0603w]
C20  10uF  [1206]
C21  10uF  [1206]
C22  0.1uF  [0603w]
C23  0.1uF  [0603w]
C24  33nF  [0805]
C25  10pF  [0603w]
C26  10uF  [7243 V Type HD]
C27  0.1uF  [0805]
C28  0.1uF  [0603w]
C29  33nF  [0805]
C30  10uF  [1206]
C31  10uF  [1206]
C32  10uF  [1206]
C33  0.1uF  [0603w]
C34  0.1uF  [0603w]
C96  0.1uF  [0603w]
C97  0.1uF  [0603w]
C103  0.1uF  [0603w]
C127  0.1uF  [0603w]
JP5  SMA  [sma_pcb_200]
JP6  SMA  [sma_pcb_200]
R21  1.5k  [0603w]
R23  49.9*  [1206]
R24  9.1k *  [0805]
R25  1k *  [0805]
R26  49.9*  [1206]
R47  10k  [VFCD1505]
U7  ADR445B  [SOIC08]
U8  AD8676  [MSOP08]  (parts A,B of 2)
U9  AD8675  [MSOP08]
U10  AD5791  [TSSOP20]
U11  OPA453  [DDPAK-7]
U19  AD8675  [MSOP08]

### Nets
+12: C13.1 C14.1 C16.2 C20.1 C23.1 C31.1 C34.1 C96.1 U7.2(VIN) U8.8(V+) U9.7(V+) U10.5(VDD) U19.7(V+)
+68: C26.1 C27.1 U11.5
-12: C18.2 C19.1 C28.1 C30.2 C32.2 C33.1 C97.1 C127.1 U8.4(V-) U9.4(V-) U10.18(VSS) U11.4 U19.4(V-)
AGND: C13.2 C14.2 C15.2 C16.1 C17.1 C18.1 C19.2 C20.2 C21.2 C22.2 C23.2 C24.1 C26.2 C27.2 C28.2 C29.1 C30.1 C31.2 C32.1 C33.2 C34.2 C96.2 C97.2 C103.2 C127.2 JP5.0(ground) JP6.0(ground) R25.1 R47.1 U7.4(GND) U10.15(DGND) U10.19(AGND) U19.3(+)  [also labelled DGND]
DVDD25: C103.1 U10.10(IOVCC)
DVDD33: C21.1 C22.1 U10.9(VCC)
~{CLR}: U10.7(~{CLR})
~{LDAC}: U10.8(~{LDAC})
~{RESET}: U10.6(~{RESET})
~{SYNC}: U10.14(~{SYNC})
SCLK: U10.13(SCLK)
SDIN: U10.12(SDIN)
SDO: U10.11(SDO)
NetC15_1: C15.1 R21.2 U9.3(+)
NetC17_2: C17.2 R21.1 U7.6(NC)
NetC24_2: C24.2 JP5.1(signal) R23.2
NetC25_1: C25.1 R23.1 U8.1(OUTA) U10.20(RFB) U11.1
NetC25_2: C25.2 U8.2(-) U10.1(INV)
NetC29_2: C29.2 JP6.1(signal) R26.2
NetR24_1: R24.1 R25.2 U11.2
NetR24_2: R24.2 R26.1 U11.6
NetR47_2: R47.2 U9.2(-)
NetR47_3: R47.3 U8.5(+) U9.6(OUT)
NetU8_3: U8.3(+) U10.2(VOUT)
NetU8_6: U8.6(-) U10.3(VREFPS)
NetU8_7: U8.7(OUTB) U10.4(VREFPF)
NetU10_16: U10.16(VREFNF) U19.6(OUT)
NetU10_17: U10.17(VREFNS) U19.2(-)

Not connected (* = marked no-connect by the designer): U7 1(NC) 5(NC); U11 7

### Notes on the sheet
- (near R47) **
- * 0.1% tolerance
- ** matched pair network package
- ADC DAC Daughter Card for Opal Kelly 6010

### Library data of the parts
C13 C15 C18 C20 C21 C30-C32 = CAPACITOR_SM: ELECTROLYTIC capacitor; Manufacturer: Nichicon; Manufacturer Part Number: F971C106MAA; Manufacturer Size Code: A; Capacitance: 10µF; ESR (Equivalent Series Resistance): 3.500 Ohm; Tolerance: ±20%; Type: Molded; Voltage - Rated: 16V; Category: Capacitors; ComponentLink1Description: http://nichicon-us.com/english/products/pdf/e-f97.pdf; ComponentLink1URL: http://nichicon-us.com/english/products/pdf/e-f97.pdf; Features: High Reliability; Height: 0.071" (1.80mm); Lead Spacing: -; Lifetime @ Temp.: -; Mounting Type: Surface Mount; Operating Temperature: -55°C ~ 125°C; Package / Case: 1206 (3216 Metric); Packaging: Cut Tape (CT); Pricing 1: 1=0.5, 10=0.398, 100=0.24, 250=0.18, 500=0.1536, 1000=0.12 (USD); RoHS: RoHS Compliant; Size / Dimension: 0.126" L x 0.063" W (3.20mm x 1.60mm); Stock 1: 885; Supplier 1: Digi-Key; Supplier Part Number 1: 493-4304-1-ND
C14 C16 C17 C19 C22 C23 C28 C33 C34 C96 C97 C103 = CAP_SM_1: as C3 on sheet OK6010_DB_ADC; Applications: General Purpose; Category: Capacitors; ComponentLink1Description: http://www.kemet.com/datasheets&C0603C104K3RACTU; ComponentLink1URL: http://www.kemet.com/datasheets&C0603C104K3RACTU; Features: -; Lead Spacing: -; Lead Style: -; Mounting Type: Surface Mount, MLCC; Operating Temperature: -55°C ~ 125°C; Package / Case: 0603 (1608 Metric); Packaging: Cut Tape (CT); Pricing 1: 10=0.075, 100=0.027, 250=0.01952, 500=0.0144, 1000=0.00975 (USD); Ratings: -; RoHS: RoHS Compliant; Size / Dimension: 0.063" L x 0.032" W (1.60mm x 0.80mm); Stock 1: 2338960; Supplier 1: Digi-Key; Supplier Part Number 1: 399-1281-1-ND; Thickness: 0.80mm
C24 C29 = CAP_SM_1: capacitor; Supplier 1: Digi-Key; Supplier Part Number 1: 490-3323-1-ND
C25 = CAP_SM_1: capacitor; Manufacturer: Murata Electronics North America; Manufacturer Part Number: GRM1885C1H100JA01D; Description: CAP CER 10PF 50V 5% C0G 0603; Voltage - Rated: 50V; Tolerance: ±5%; Temperature Coefficient: C0G, NP0; Supplier 1: Digi-Key; Supplier Part Number 1: 490-1403-1-ND; RoHS: RoHS Compliant; Category: Capacitors; Stock 1: 256478; Pricing 1: 1=0.14, 10=0.085, 50=0.0408, 100=0.0306, 250=0.02212, 500=0.01632, 1000=0.01105 (USD); Capacitance: 10pF; Mounting Type: Surface Mount, MLCC; Operating Temperature: -55°C ~ 125°C; Applications: General Purpose; Ratings: -; Package / Case: 0603 (1608 Metric); Size / Dimension: 0.063" L x 0.031" W (1.60mm x 0.80mm); Height: -; Thickness: 0.035" (0.90mm); Lead Spacing: -; Features: -; Packaging: Cut Tape (CT); Lead Style: -; ComponentLink1URL: http://search.murata.co.jp/Ceramy/image/img/PDF/ENG/GRM1885C1H100JA01.pdf; ComponentLink1Description: http://search.murata.co.jp/Ceramy/image/img/PDF/ENG/GRM1885C1H100JA01.pdf
C26 = CAPACITOR_SM: ELECTROLYTIC capacitor; Manufacturer: Panasonic - ECG; Manufacturer Part Number: EEE-HD2A100P; Description: CAP 10UF 100V ELECT HD SMD; Capacitance: 10µF; Voltage Rating: 100V; Tolerance: ±20%; Lifetime @ Temp.: 5000 Hrs @ 105°C; Ripple Current: 55mA; Impedance: 1.5 Ohm; Surface Mount Land Size: 0.327" L x 0.327" W (8.30mm x 8.30mm); Supplier 1: Digi-Key; Supplier Part Number 1: PCE4986CT-ND; RoHS: RoHS Compliant; Category: Capacitors; Stock 1: 18795; Pricing 1: 1=0.98, 50=0.6264, 100=0.5638, 250=0.48548 (USD); Operating Temperature: -40°C ~ 105°C; Features: General Purpose; ESR (Equivalent Series Resistance): -; Mounting Type: Surface Mount; Package / Case: Radial, Can - SMD; Size / Dimension: 0.315" Dia (8.00mm); Height: 0.402" (10.20mm); Lead Spacing: -; Packaging: Cut Tape (CT); ComponentLink1URL: http://media.digikey.com/pdf/Data%20Sheets/Panasonic%20Capacitors%20PDFs/V%20Type%20HD%20Series.pdf; ComponentLink1Description: http://media.digikey.com/pdf/Data%20Sheets/Panasonic%20Capacitors%20PDFs/V%20Type%20HD%20Series.pdf
C27 = CAP_SM_1: capacitor; Manufacturer: Murata Electronics North America; Manufacturer Part Number: GCM21BR72A104KA37L; Description: CAP CER .1UF 100V X7R 0805; Capacitance: 0.1µF; Voltage - Rated: 100V; Tolerance: ±10%; Temperature Coefficient: X7R; Supplier 1: Digi-Key; Supplier Part Number 1: 490-4789-1-ND; RoHS: RoHS Compliant; Category: Capacitors; Stock 1: 131677; Pricing 1: 10=0.302, 50=0.1758, 100=0.1407, 250=0.10052, 500=0.06834, 1000=0.05528 (USD); Mounting Type: Surface Mount, MLCC; Operating Temperature: -55°C ~ 125°C; Applications: Automotive; Ratings: AEC-Q200; Package / Case: 0805 (2012 Metric); Size / Dimension: 0.079" L x 0.049" W (2.00mm x 1.25mm); Height: -; Thickness: 0.055" (1.40mm); Lead Spacing: -; Features: -; Packaging: Cut Tape (CT); Lead Style: -; ComponentLink1URL: http://search.murata.co.jp/Ceramy/image/img/PDF/ENG/GCM21BR72A104KA37.pdf; ComponentLink1Description: http://search.murata.co.jp/Ceramy/image/img/PDF/ENG/GCM21BR72A104KA37.pdf
C127 = CAP_SM: capacitor; Supplier 1: Digi-Key; Supplier Part Number 1: 399-1281-1-ND
JP5 JP6 = SMA_EDGE: as JP1 on sheet OK6010_DB_ADC; Cable Group: -; Category: Connectors, Interconnects; Color: -; ComponentLink1Description: http://documents.tycoelectronics.com/commerce/DocumentDelivery/DDEController?Action=srchrtrv&DocNm=1814832&DocType=CD&DocLang=EN; ComponentLink1URL: http://documents.tycoelectronics.com/commerce/DocumentDelivery/DDEController?Action=srchrtrv&DocNm=1814832&DocType=CD&DocLang=EN; Connector Style: SMA; Fastening Type: Threaded; Features: -; Mounting Type: Through Hole; Packaging: Bulk; Pricing 1: 1=2.7, 25=2.322, 50=2.052, 100=1.836, 250=1.62, 500=1.4364 (USD); RoHS: RoHS Compliant; Stock 1: 22563; Supplier 1: Digi-Key; Supplier Part Number 1: A97594-ND
R21 = RES_SM: resistor; Manufacturer: Yageo; Manufacturer Part Number: RC0603FR-071K5L; Description: RES 1.50K OHM 1/10W 1% 0603 SMD; Power (Watts): 0.1W, 1/10W; Temperature Coefficient: ±100ppm/°C; Tolerance: ±1%; Supplier 1: Digi-Key; Supplier Part Number 1: 311-1.50KHRCT-ND; RoHS: RoHS Compliant; Category: Resistors; Stock 1: 822850; Pricing 1: 10=0.014, 50=0.0104, 100=0.0079, 250=0.00584, 500=0.00432, 1000=0.00288 (USD); Resistance (Ohms): 1.5K; Composition: Thick Film; Features: -; Size / Dimension: 0.063" L x 0.031" W (1.60mm x 0.80mm); Height: 0.018" (0.45mm); Number of Terminations: 2; Packaging: Cut Tape (CT); Package / Case: 0603 (1608 Metric); ComponentLink1URL: http://www.yageo.com/documents/recent/PYu-RC0603_51_RoHS_L_4.pdf; ComponentLink1Description: http://www.yageo.com/documents/recent/PYu-RC0603_51_RoHS_L_4.pdf
R23 R26 = RES_SM: resistor; Manufacturer: Susumu; Manufacturer Part Number: RG3216P-49R9-B-T1; Description: RES 49.9 OHM 1/4W .1% 1206; Resistance (Ohms): 49.9; Power (Watts): 0.25W, 1/4W; Temperature Coefficient: ±25ppm/°C; Tolerance: ±0.1%; Supplier 1: Digi-Key; Supplier Part Number 1: RG32P49.9BCT-ND; RoHS: RoHS Compliant; Category: Resistors; Stock 1: 6020; Pricing 1: 10=0.612, 50=0.4354, 200=0.3402 (USD); Composition: Thin Film; Features: -; Size / Dimension: 0.126" L x 0.063" W (3.20mm x 1.60mm); Height: 0.016" (0.40mm); Number of Terminations: 2; Packaging: Cut Tape (CT); Package / Case: 1206 (3216 Metric); ComponentLink1URL: http://www.susumu.co.jp/english/pdf/e-databook7.pdf; ComponentLink1Description: http://www.susumu.co.jp/english/pdf/e-databook7.pdf
R24 = RES_SM: resistor; Manufacturer: Susumu; Manufacturer Part Number: RG2012P-912-B-T5; Description: RES 9.1K OHM 1/8W .1% 0805 SMD; Power (Watts): 0.125W, 1/8W; Temperature Coefficient: ±25ppm/°C; Tolerance: ±0.1%; Supplier 1: Digi-Key; Supplier Part Number 1: RG20P9.1KBCT-ND; RoHS: RoHS Compliant; Category: Resistors; Stock 1: 12782; Pricing 1: 10=0.409, 50=0.2478, 200=0.2047, 1000=0.10342 (USD); Resistance (Ohms): 9.1K; Composition: Thin Film; Features: -; Size / Dimension: 0.079" L x 0.049" W (2.00mm x 1.25mm); Height: 0.016" (0.40mm); Number of Terminations: 2; Packaging: Cut Tape (CT); Package / Case: 0805 (2012 Metric); ComponentLink1URL: http://www.susumu.co.jp/english/pdf/products-j01-01.pdf; ComponentLink1Description: http://www.susumu.co.jp/english/pdf/products-j01-01.pdf; Supplier 2: Digi-Key; Supplier Part Number 2: RG1608P-9091-B-T1-ND; Stock 2: 0; Pricing 2: 1000=0.08165 (USD); ComponentLink2URL: http://www.susumu-usa.com/pdf/products_8_9.pdf; ComponentLink2Description: http://www.susumu-usa.com/pdf/products_8_9.pdf
R25 = RES_SM: resistor; Supplier 1: Digi-Key; Supplier Part Number 1: RG20P1.0KBCT-ND
R47 = res_div VFCD1505: resistor network; Manufacturer: Vishay Foil Resistors (Division of Vishay Precision Group); Manufacturer Part Number: Y1685V0001TT9W; Description: RES DIV 10K/10K .01% FOIL SMD; Number of Resistors: 2; Circuit Type: Common; Temperature Coefficient: ±0.2ppm/°C; Tolerance: ±0.01%; Power Per Element: 100mW; Supplier 1: Digi-Key; Supplier Part Number 1: Y1685-10K/10K-ND; RoHS: RoHS Compliant; Category: Resistors; Stock 1: 225; Pricing 1: 1=24.42, 25=19.2752, 100=17.6688, 250=16.705, 500=16.0625 (USD); Resistance (Ohms): 10K; Number of Pins: 3; Applications: -; Package / Case: 1505 (3813 Metric); Size / Dimension: 0.150" L x 0.050" W (3.81mm x 1.27mm); Height: 0.025" (0.64mm); Mounting Type: Surface Mount; Packaging: Tube; Operating Temperature: -55°C ~ 125°C; Supplier Device Package: -; ComponentLink1URL: http://www.vishaypg.com/docs/63109/vfcd1505.pdf; ComponentLink1Description: http://www.vishaypg.com/docs/63109/vfcd1505.pdf
U7 = ADR42x: Ultra Precision Low Noise XFET Voltage Reference; Manufacturer: Analog Devices Inc; Manufacturer Part Number: ADR445BRZ; Description: IC VREF LDO XFET 5.0V 8-SOIC; Reference Type: Series, Precision; Voltage - Output: 5V; Tolerance: ±0.04%; Temperature Coefficient: 3ppm/°C; Voltage - Input: 5.5 V ~ 18 V; Number of Channels: 1; Current - Quiescent: 3.75mA; Current - Output: 10mA; Supplier 1: Digi-Key; Supplier Part Number 1: ADR445BRZ-ND; RoHS: RoHS Compliant; Category: Integrated Circuits (ICs); Stock 1: 4260; Pricing 1: 1=8.75, 25=7.1752, 100=6.475, 250=5.95, 500=5.425, 1000=4.725, 2500=4.55, 5000=4.375 (USD); Current - Cathode: -; Operating Temperature: -40°C ~ 125°C; Mounting Type: Surface Mount; Package / Case: 8-SOIC (0.154", 3.90mm Width); Supplier Device Package: 8-SOIC; Packaging: Tube; ComponentLink1URL: http://www.analog.com/static/imported-files/Data_Sheets/ADR440_441_443_444_445.pdf; ComponentLink1Description: http://www.analog.com/static/imported-files/Data_Sheets/ADR440_441_443_444_445.pdf
U8 = AD8676: ultraprecision dual rail-to-rail op amp; Manufacturer: Analog Devices Inc; Manufacturer Part Number: AD8676BRMZ-REEL; Description: IC OPAMP GP R-R 10MHZ DUAL 8MSOP; Amplifier Type: General Purpose; Number of Circuits: 2; Slew Rate: 2.5 V/µs; Gain Bandwidth Product: 10MHz; Current - Input Bias: 2nA; Voltage - Input Offset: 12µV; Current - Supply: 2.7mA; Current - Output / Channel: 20mA; Voltage - Supply, Single/Dual (±): 10 V ~ 36 V, ±5 V ~ 18 V; Supplier 1: Digi-Key; Supplier Part Number 1: AD8676BRMZ-REELCT-ND; RoHS: RoHS Compliant; Category: Integrated Circuits (ICs); Stock 1: 23534; Pricing 1: 1=6.6, 25=5.39, 100=4.84, 250=4.4, 500=3.85, 1000=3.3 (USD); Output Type: Rail-to-Rail; -3db Bandwidth: -; Operating Temperature: -40°C ~ 125°C; Mounting Type: Surface Mount; Package / Case: 8-TSSOP, 8-MSOP (0.118", 3.00mm Width); Supplier Device Package: 8-MSOP; Packaging: Cut Tape (CT); ComponentLink1URL: http://www.analog.com/static/imported-files/Data_Sheets/AD8676.pdf; ComponentLink1Description: http://www.analog.com/static/imported-files/Data_Sheets/AD8676.pdf
U9 U19 = AD8675: ultraprecision  rail-to-rail op amp; Manufacturer: Analog Devices Inc; Manufacturer Part Number: AD8675ARMZ-REEL; Description: IC OPAMP GP R-R 10MHZ PREC 8MSOP; Amplifier Type: General Purpose; Number of Circuits: 1; Slew Rate: 2.5 V/µs; Gain Bandwidth Product: 10MHz; Current - Input Bias: 500pA; Voltage - Input Offset: 10µV; Current - Supply: 2.5mA; Current - Output / Channel: 20mA; Voltage - Supply, Single/Dual (±): 10 V ~ 36 V, ±5 V ~ 18 V; Supplier 1: Digi-Key; Supplier Part Number 1: AD8675ARMZ-REELCT-ND; RoHS: RoHS Compliant; Category: Integrated Circuits (ICs); Stock 1: 6848; Pricing 1: 1=3.66, 25=2.9892, 100=2.684, 250=2.44, 500=2.135, 1000=1.83 (USD); Output Type: Rail-to-Rail; -3db Bandwidth: -; Operating Temperature: -40°C ~ 125°C; Mounting Type: Surface Mount; Package / Case: 8-TSSOP, 8-MSOP (0.118", 3.00mm Width); Supplier Device Package: 8-MSOP; Packaging: Cut Tape (CT); ComponentLink1URL: http://www.analog.com/static/imported-files/Data_Sheets/AD8675.pdf; ComponentLink1Description: http://www.analog.com/static/imported-files/Data_Sheets/AD8675.pdf
U10 = AD5791: DAC 20BIT SRL 20TSSOP; Manufacturer: Analog Devices Inc; Manufacturer Part Number: AD5791ARUZ; Description: IC DAC 20BIT UNBUFF 20-TSSOP; Settling Time: 1µs; Number of Bits: 20; Data Interface: DSP, MICROWIRE™, QSPI™, Serial, SPI™; Number of Converters: 1; Voltage Supply Source: Dual ±; Supplier 1: Digi-Key; Supplier Part Number 1: AD5791ARUZ-ND; RoHS: RoHS Compliant; Category: Integrated Circuits (ICs); Stock 1: 0; Pricing 1: 1=66.31, 25=59.2804, 100=56.266, 250=53.45272, 500=51.74462, 1000=49.63465 (USD); Power Dissipation (Max): -; Operating Temperature: -40°C ~ 125°C; Mounting Type: Surface Mount; Package / Case: 20-TSSOP (0.173", 4.40mm Width); Supplier Device Package: 20-TSSOP; Packaging: Tube; ComponentLink1URL: http://www.analog.com/static/imported-files/data_sheets/AD5791.pdf; ComponentLink1Description: http://www.analog.com/static/imported-files/data_sheets/AD5791.pdf
U11 = OPA453: 80 V op amp; Manufacturer: Texas Instruments; Manufacturer Part Number: OPA453FAKTWT; Description: IC OPAMP GP 7.5MHZ SGL TO220-7; Amplifier Type: General Purpose; Number of Circuits: 1; Slew Rate: 38 V/µs; Gain Bandwidth Product: 7.5MHz; Current - Input Bias: 7pA; Voltage - Input Offset: 1000µV; Current - Supply: 5.5mA; Current - Output / Channel: 50mA; Voltage - Supply, Single/Dual (±): 20 V ~ 80 V, ±10 V ~ 40 V; Supplier 1: Mouser; Supplier Part Number 1: 595-OPA453FAKTWT; RoHS: RoHS Compliant; Category: Integrated Circuits (ICs); Stock 1: 0; Pricing 1: 1=6.76, 25=5.61 (USD); Output Type: -; -3db Bandwidth: -; Operating Temperature: -40°C ~ 125°C; Mounting Type: Surface Mount; Package / Case: TO-263-8, D²Pak (7 Leads + Tab), TO-263CA; Supplier Device Package: 7-DDPAK; Packaging: Cut Tape (CT); ComponentLink1URL: http://focus.ti.com/lit/ds/symlink/opa452.pdf; ComponentLink1Description: http://focus.ti.com/lit/ds/symlink/opa452.pdf; Supplier 2: Mouser; Supplier 2 Part Number: 595-OPA453FAKTWT